# EAGLE design femtoBeacon_board_nRF52832_BT4.2_r1.0.0 (EAGLE 7.5.0)

## Sheet 1 of 2
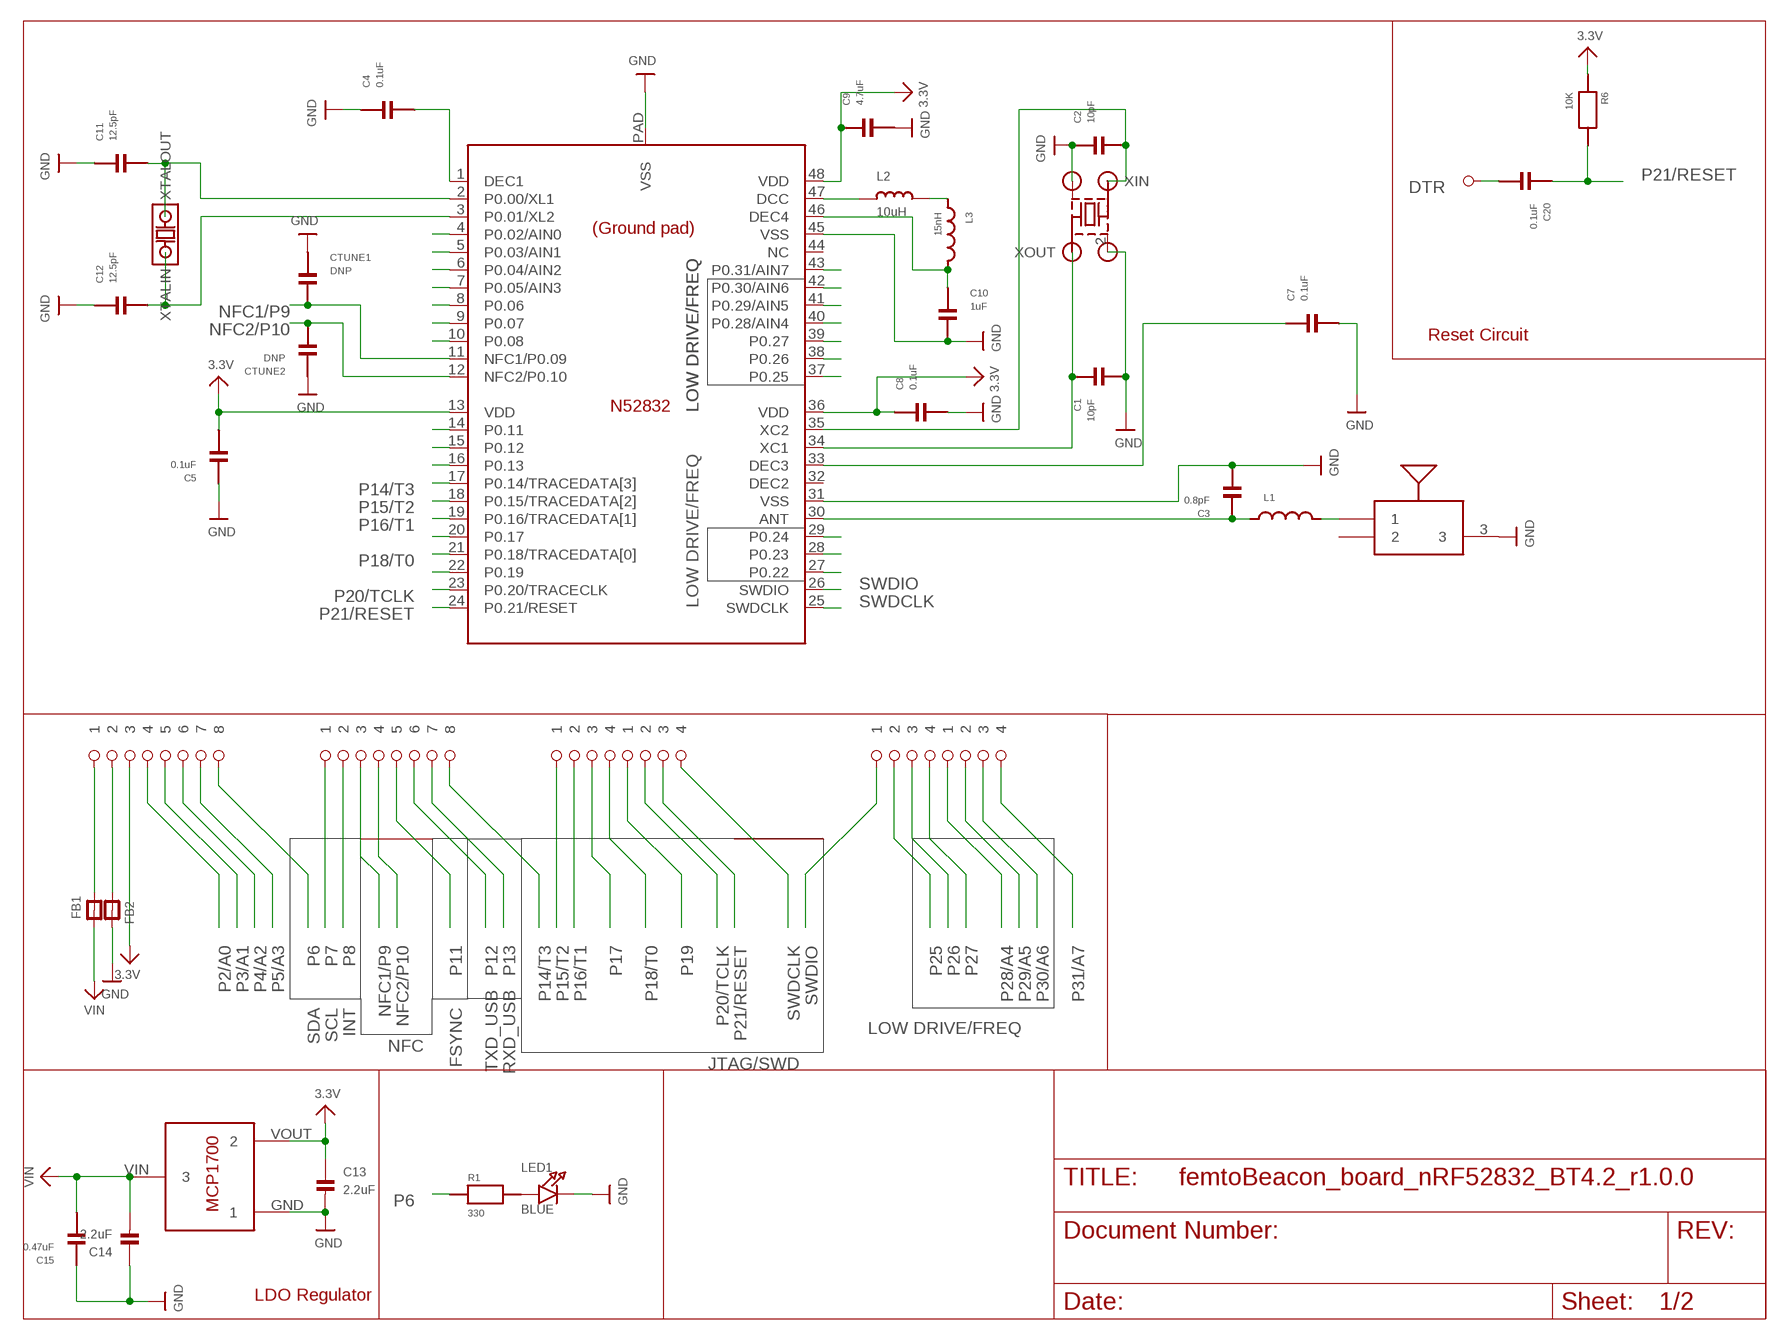
[diagram p0: schematic, sheet 1]

### Parts
ANTBAR  PULSE_ANT_2.4GHZ  [ANT_BAR]
C1  10pF  CAPACITOR_0201  [PART]
C2  10pF  CAPACITOR_0201  [PART]
C3  0.8pF  CAPACITOR_0201  [PART]
C4  0.1uF  CAPACITOR_0201  [PART]
C5  0.1uF  CAPACITOR_0201  [PART]
C7  0.1uF  CAPACITOR_0201  [PART]
C8  0.1uF  CAPACITOR_0201  [PART]
C9  4.7uF  CAPACITOR_0201  [PART]
C10  1uF  CAPACITOR_0201  [PART]
C11  12.5pF  CAPACITOR_0201  [PART]
C12  12.5pF  CAPACITOR_0201  [PART]
C13  2.2uF  CAP_CERAMIC_0402MP  [_0402MP]
C14  2.2uF  CAP_CERAMIC_0402MP  [_0402MP]
C15  0.47uF  CAPACITOR_0201  [PART]
C20  0.1uF  CAPACITOR_0201  [PART]
CTUNE1  DNP  CAPACITOR_0201  [PART]
CTUNE2  DNP  CAPACITOR_0201  [PART]
FB1  FERRITE_0603MP  [_0603MP]
FB2  FERRITE_0603MP  [_0603MP]
IC1  NRF52832_QFN48  [QFN48]
L1  INDUCTOR_FIXED_0201  [PART]
L2  10uH  INDUCTOR_0603MP  [_0603MP]
L3  15nH  INDUCTOR_FIXED_0201  [PART]
LED1  BLUE  LED0603_NOOUTLINE  [CHIPLED_0603_NOOUTLINE]
PIN4  1X1_ROUND  [1X1_ROUND]
PINS1  1X8_ROUND  [1X8_ROUND]
PINS2  1X8_ROUND  [1X8_ROUND]
PINS3A  1X4_ROUND  [1X4_ROUND]
PINS3B  1X4_ROUND  [1X4_ROUND]
PINS4A  1X4_ROUND  [1X4_ROUND]
PINS4B  1X4_ROUND  [1X4_ROUND]
R1  330  RESISTOR_0201  [PART]
R6  10K  RESISTOR_0201  [PART]
U$4  MCP1700T-3302E/TT  [MCP1700T-3302E/TT]
U$53  ABS06-107-32.768KHZ-T  [ABS06-107-32.768KHZ-T]
XTAL  32MHz  ABM11-32.000MHZ-D2X-T3  [ABM11]

### Nets
3.3V: C5.2 C8.1 C9.1 C13.1 IC1.13(VDD) IC1.36(VDD) IC1.48(VDD) PINS1.P$3 R6.1 U$4.VOUT ; also sheet 2
DTR: C20.2 PIN4.P$1
GND: ANTBAR.3 C1.2 C2.1 C3.2 C4.1 C5.1 C7.2 C8.2 C9.2 C10.2 C11.1 C12.1 C13.2 C14.1 C15.1 CTUNE1.1 CTUNE2.1 FB2.2 IC1.31(VSS) IC1.45(VSS) IC1.PAD(VSS) LED1.C U$4.GND XTAL.2(GND) XTAL.4(GND) ; also sheet 2
N$1: C4.2 IC1.1(DEC1)
N$2: L2.2 L3.1
N$3: IC1.47(DCC) L2.1
N$4: C7.1 IC1.33(DEC3)
N$5: FB2.1 PINS1.P$2
N$6: C10.1 IC1.46(DEC4) L3.2
N$7: LED1.A R1.2
N$8: FB1.2 PINS1.P$1
N$13: C3.1 IC1.30(ANT) L1.1
NFC1/P9: CTUNE1.2 IC1.11(NFC1/P0.09) PINS2.P$3
NFC2/P10: CTUNE2.2 IC1.12(NFC2/P0.10) PINS2.P$4
P0/XIN32: C11.2 IC1.2(P0.00/XL1) U$53.2(XTALOUT)
P1/XOUT32: C12.2 IC1.3(P0.01/XL2) U$53.1(XTALIN)
P2/A0: IC1.4(P0.02/AIN0) PINS1.P$4
P3/A1: IC1.5(P0.03/AIN1) PINS1.P$5
P4/A2: IC1.6(P0.04/AIN2) PINS1.P$6
P5/A3: IC1.7(P0.05/AIN3) PINS1.P$7
P6: IC1.8(P0.06) PINS1.P$8 R1.1 ; also sheet 2
P7: IC1.9(P0.07) PINS2.P$1 ; also sheet 2
P8: IC1.10(P0.08) PINS2.P$2 ; also sheet 2
P11: IC1.14(P0.11) PINS2.P$5 ; also sheet 2
P12: IC1.15(P0.12) PINS2.P$6
P13: IC1.16(P0.13) PINS2.P$7
P14/T3: IC1.17(P0.14/TRACEDATA[3]) PINS2.P$8
P15/T2: IC1.18(P0.15/TRACEDATA[2]) PINS3A.P$1
P16/T1: IC1.19(P0.16/TRACEDATA[1]) PINS3A.P$2
P17: IC1.20(P0.17) PINS3A.P$3
P18/T0: IC1.21(P0.18/TRACEDATA[0]) PINS3A.P$4
P19: IC1.22(P0.19) PINS3B.P$1
P20/TCLK: IC1.23(P0.20/TRACECLK) PINS3B.P$2
P21/RESET: C20.1 IC1.24(P0.21/RESET) PINS3B.P$3 R6.2
P22: IC1.27(P0.22)
P23: IC1.28(P0.23)
P24: IC1.29(P0.24)
P25: IC1.37(P0.25) PINS4A.P$2
P26: IC1.38(P0.26) PINS4A.P$3
P27: IC1.39(P0.27) PINS4A.P$4
P28/A4: IC1.40(P0.28/AIN4) PINS4B.P$1
P29/A5: IC1.41(P0.29/AIN5) PINS4B.P$2
P30/A6: IC1.42(P0.30/AIN6) PINS4B.P$3
P31/A7: IC1.43(P0.31/AIN7) PINS4B.P$4
RF: ANTBAR.1 L1.2
SWDCLK: IC1.25(SWDCLK) PINS3B.P$4
SWDIO: IC1.26(SWDIO) PINS4A.P$1
VIN: C14.2 C15.2 FB1.1 U$4.VIN
XIN: C1.1 IC1.34(XC1) XTAL.3(XOUT)
XOUT: C2.2 IC1.35(XC2) XTAL.1(XIN)
Unconnected: ANTBAR.2 IC1.32(DEC2) IC1.44(NC)

### Notes on the sheet
- Reset Circuit
- LOW DRIVE/FREQ | LOW DRIVE/FREQ
- LOW DRIVE/FREQ
- TXD_USB | RXD_USB
- SDA | SCL | INT | FSYNC
- LOW DRIVE/FREQ
- NFC
- JTAG/SWD
- LDO Regulator

## Sheet 2 of 2
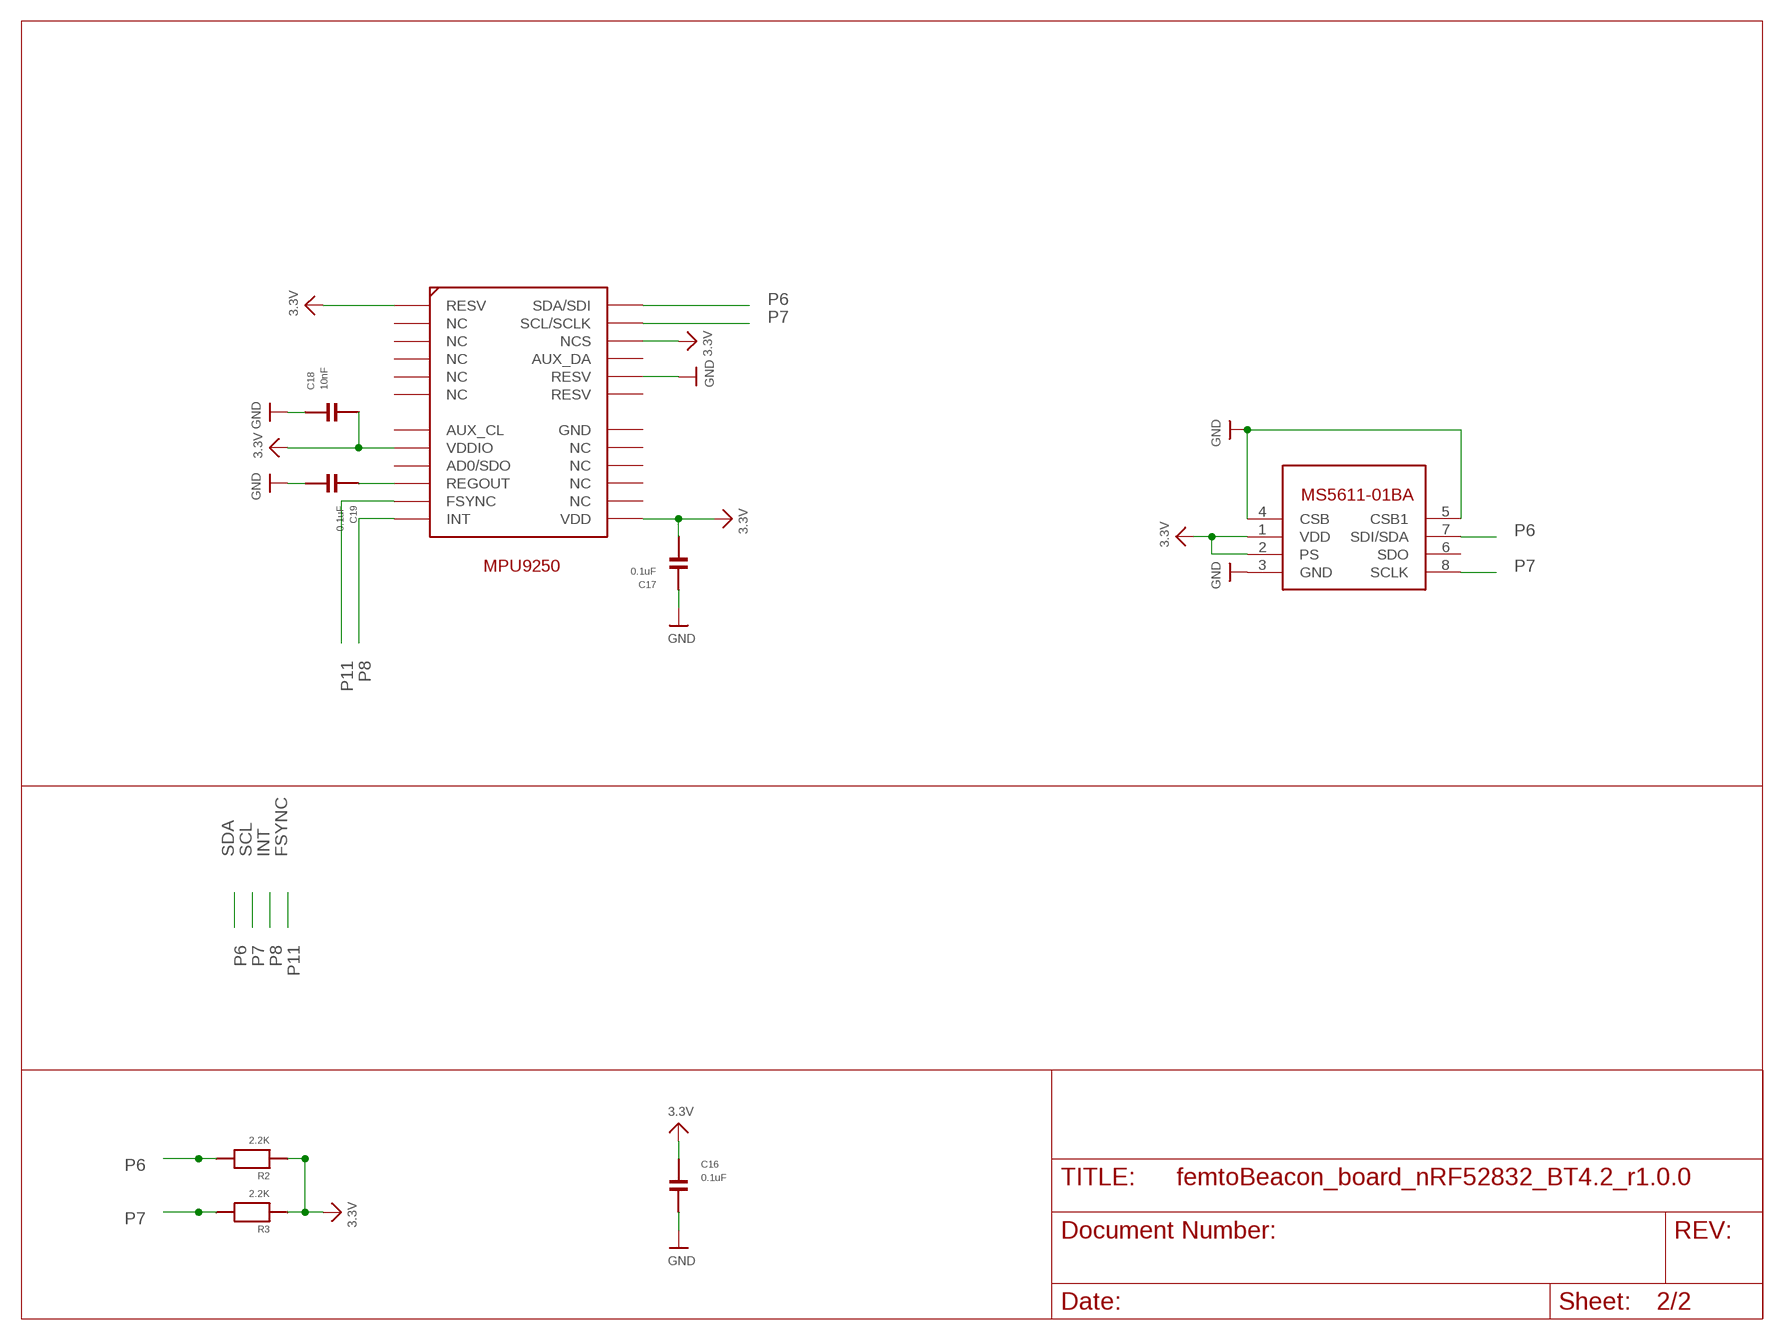
[diagram p1: schematic, sheet 2]

### Parts
BARO1  MS5611-01BA03  [MS5611-01BA03]
C16  0.1uF  CAPACITOR_0201  [PART]
C17  0.1uF  CAPACITOR_0201  [PART]
C18  10nF  CAPACITOR_0201  [PART]
C19  0.1uF  CAPACITOR_0201  [PART]
IMU1  MPU-9250  [QFN_3X3MM]
R2  2.2K  RESISTOR_0201  [PART]
R3  2.2K  RESISTOR_0201  [PART]

### Nets
3.3V: BARO1.1(VDD) BARO1.2(PS) C16.1 C17.2 C18.2 IMU1.P$1(RESV) IMU1.P$8(VDDIO) IMU1.P$13(VDD) IMU1.P$22(NCS) R2.1 R3.1 ; also sheet 1
GND: BARO1.3(GND) BARO1.4(CSB) BARO1.5(CSB1) C16.2 C17.1 C18.1 C19.2 IMU1.P$20(RESV) ; also sheet 1
P6: BARO1.7(SDI/SDA) IMU1.P$24(SDA/SDI) R2.2 ; also sheet 1
P7: BARO1.8(SCLK) IMU1.P$23(SCL/SCLK) R3.2 ; also sheet 1
P8: IMU1.P$12(INT) ; also sheet 1
P11: IMU1.P$11(FSYNC) ; also sheet 1
REGOUT: C19.1 IMU1.P$10(REGOUT)
Unconnected: BARO1.6(SDO) IMU1.P$2(NC) IMU1.P$3(NC) IMU1.P$4(NC) IMU1.P$5(NC) IMU1.P$6(NC) IMU1.P$7(AUX_CL) IMU1.P$9(AD0/SDO) IMU1.P$14(NC) IMU1.P$15(NC) IMU1.P$16(NC) IMU1.P$17(NC) IMU1.P$18(GND) IMU1.P$19(RESV) IMU1.P$21(AUX_DA)

### Notes on the sheet
- MPU9250
- SDA | SCL | INT | FSYNC

## Library data of the parts
ANTBAR = bar_antenna:PULSE_ANT_2.4GHZ: Manufacturer part #W3008
BARO1 = freeimu:MS5611-01BA03
C1-C5 C7-C12 C15-C20 CTUNE1 CTUNE2 = parts_0201:CAPACITOR_0201
C13 C14 = microbuilder:CAP_CERAMIC: Ceramic Capacitors 0402 - 0402 Surface Mount Capacitors 16pF 50V 5% [Digikey: 445-4899-2-ND] 18pF 50V 5% [Digikey: 490-1281-2-ND] 22pF 50V 5% [Digikey: 490-1283-2-ND] 68pF 50V 5% [Digikey: 490-1289-2-ND] 0.1uF 10V 10% [Digikey: 490-1318-2-ND] 1.0uF 6.3V 10% [Digikey: 490-1320-2-ND] 0603 - 0603 Surface Mount Capacitors 16 pF 50V 5% [Digikey: 445-5051-2-ND] 22 pF 50V [Digikey: PCC220ACVTR-ND] 33 pF 50V 5% [Digikey: 490-1415-1-ND] 56pF 50V 5% [Digikey: 490-1421-1-ND] 220pF 50V 5% [Digikey: 445-1285-1-ND] 680 pF 50V 2200 pF 50V 5% C0G [Digikey: 445-1297-1-ND] 5600 pF 100V 5% X7R [Digikey: 478-3711-1-ND] 0.1 µF 25V 10% [Digikey: PCC2277TR-ND] 0.22 µF 16V 10% X7R [Digikey: 445-1318-1-ND] 1.0 µF 25V 10% [Digikey: 445-5146-2-ND] 0603 - RF Specific 3pF 250V +/-0.1pF RF [Digikey: 712-1347-1-ND] 18 pF 250V 5% [Digikey: 478-3505-1-ND or 712-1322-1-ND] 56 pF 250V 5% C0G RF [Digikey: 490-4867-1-ND] 68 pF 250V RF [Digikey: 490-4868-1-ND] 0805 - 0805 Surface Mount Capacitors 220 pF 250V 2% RF Ceramic Capacitor [Digikey: 712-1398-1-ND] 1000 pF 50V 2% NP0 Ceramic Capacitor [Digikey: 478-3760-1-ND] 0.1 µF 25V 10% Ceramic Capacitor [Digikey: PCC1828TR-ND] 1.0 µF 16V 10% Ceramic Capacitor[Digikey: 490-1691-2-ND] 10.0 µF 10V 10% Ceramic Capacitor[Digikey: 709-1228-1-ND] 10.0 uF 16V 10% Ceramic Capacitor [Digikey: 478-5165-2-ND] 47 uF 6.3V 20% Ceramic Capacitor [Digikey: 587-1779-1-ND or 399-5506-1-ND] 1206 - 1206 Surface Mount Capacitors 47uF 10V 20% Ceramic Capacitor [Digikey: 490-5528-1-ND or 399-5508-1-ND or 445-6010-1-ND] 100uF 6.3V -20%, +80% Y5V Ceramic Capacitor (Digikey: 490-4512-1-ND, Mouser: 81-GRM31CF50J107ZE1L)
FB1 FB2 = microbuilder:FERRITE: Ferrite Bead 0603 MMZ1608B121C - 120 Ohm @ 100MHz, 600mA, 0.15 Ohm DC Resistance - Digikey: 445-2164-1-ND BK1608HW121-T - 120 Ohm, 600mA Ferrite Chip - Digikey: 587-1876-2-ND 0805 HZ0805B272R-10 - 2.7K Ohm @ 100MHz, 200mA, 0.8 Ohm DC Resistance - Digikey: 240-2504-1-ND (see also Murata BLM21BD272SN1L) MMZ2012Y152B - 1.5K Ohm @ 100MHz, 500mA, 0.4 Ohm DC Resistance - Digikey: 445-1560-1-ND - Mainly for high frequency (80-400MHz) MMZ2012R102A - 1K Ohm @ 100MHz, 500mA, 0.3 Ohm DC Resistance - Digikey: 445-1555-2-ND - More general purpose (10-200MHz)
IC1 = nordic-nrf52832:NRF52832_QFN48: Nordic nRF52832 QFN48 chip (6mm x 6mm). Supports BT 4.2, NFC, iPv6
IMU1 = mpu9250:MPU-9250
L1 L3 = parts_0201:INDUCTOR_FIXED_0201
L2 = microbuilder:INDUCTOR: Inductors 0603: 10nH Ceramic Inductor - microwire antenna/RF (Digikey: 712-1434-2-ND) 0805: 560nH Ceramic Inductor - RF (Digikey: 553-1047-1-ND) 270nH Ceramic Inductor - Q = 40@250MHz, +-5%, 1 Ohm DC Resistance (Digikey: 535-10506-2-ND) 1007 (2518 Metric) SMT: 10µH 10% 250mOhm 820mA 1007 Inductor (Digikey: 587-2189-1-ND) 22µH 10% 500mOhm 580mA 1007 Inductor (Digikey: 587-2190-1-ND) 47µH 10% 950mOhm 420mA 1007 Inductor (Digikey: 587-2191-1-ND) 47µH 5% 100mOhm 1A 1008 Inductor (Digikey: 732-1816-1-ND) 5.0x5.0mm (Taiyo Yuden NR5040 Series) 6.8µH 20% 2.3A 64mOhm Inductor (Digikey: 587-2374-2-ND) 5.0x5.0mm (TDK VLC5045 Series) 4.7µH 20% 3.3A 34mOhm Inductor (Digikey: 445-6526-1-ND) 6.8µH 20% 2.7A 46mOhm Inductor (Digikey: 445-6527-1-ND) 6.0x6.0mm (TDK VLC6045 Series) 4.7µH 20% 3.8A 27mOhm Inductor (Digikey: 445-6538-2-ND) 6.8µH 20% 3A 41mOhm Inductor (Digikey: 445-6540-1-ND) 6.2µH 30% 2.2A 45mOhm Inductor (Digikey: SRR5028-6R2YCT-ND) - Not TDK VLC6045 but footprint should match 6.0x6.0mm (TDK SLF6045 Series) 6.8uH 30% 2A 33mOhm Inductor (Digikey: 445-4572-1-ND, Mouser: 810-SLF645T6R8N2R0PF)
LED1 = microbuilder:LED: LED 0603 - 0603 Surface Mount Package 2mA: Green LED - Low Power (3.9mcd, 2ma, 1.7Vf) - Digikey: 475-2709-2-ND Orange LED - Low Power (9.8mcd, 2ma, 1.8Vf) - Digikey: 475-1194-2-ND Red LED - Low Power (5mcd, 2ma, 1.8Vf) - Digikey: 475-1195-2-ND Yellow LED - Low Power (7mcd, 2ma, 1.8Vf) - Digikey: 475-1196-2-ND 5mA: Blue LED - Low Power (17mcd, 5ma, 2.9Vf) - Digikey: LNJ937W8CRACT-ND 0805 - 0805 Surface Mount Package 2mA: Red LED (8.8mcd, 2mA, 1.8Vf, Clear) - Low Power [Digikey: 475-2510-1-ND] Green LED (5mcd, 2mA, 1.8Vf, Clear) - Low Power [Digikey: 475-2730-1-ND] Yellow LED (11.3mcd, 2mA, 1.8Vf, Clear) - Low Power [Digikey: 475-2555-1-ND] 20mA: Red LED (104mcd, 20mA, Diffused) - LS R976 [Digikey: 475-1278-6-ND] Red LED (12mcd, 20mA, 2.0Vf, Clear) - APT2012EC [Digikey: 754-1128-1-ND] Green LED (15mcd, 20mA, 2.2Vf, Clear) - APT2012GC [Digikey: 754-1131-1-ND] Orange LED (160mcd, 20mA, 2.1Vf, Clear) - APT2012SECK [Digikey: 754-1130-1-ND] 1206 - 1206 Surface Mount Package Green LED (26mcd, 20mA, Diffused) - LG N971 [Digikey: 475-1407-6-ND] Red LED (15mcd, 20mA, Diffused) - LH N974 [Digikey: 475-1416-6-ND]
PIN4 = pins_1.27mm_pitch:1X1_ROUND
PINS1 PINS2 = pins_1.27mm_pitch:1X8_ROUND
PINS3A PINS3B PINS4A PINS4B = pins_1.27mm_pitch:1X4_ROUND
R1-R3 R6 = parts_0201:RESISTOR_0201
U$4 = MCP1700T-3302E_TT:MCP1700T-3302E/TT: Microchip LDO "MCP1700" in a 3-Pin SOT-23 package. ID: MCP1700T-3302E/TT
U$53 = crystals:ABS06-107-32.768KHZ-T: ABS06-107-32.768kHz-T Crystal Oscillator
XTAL = crystals:ABM11-32.000MHZ-D2X-T3: Mouser part 815-ABM11-32-D2XT3

## Board
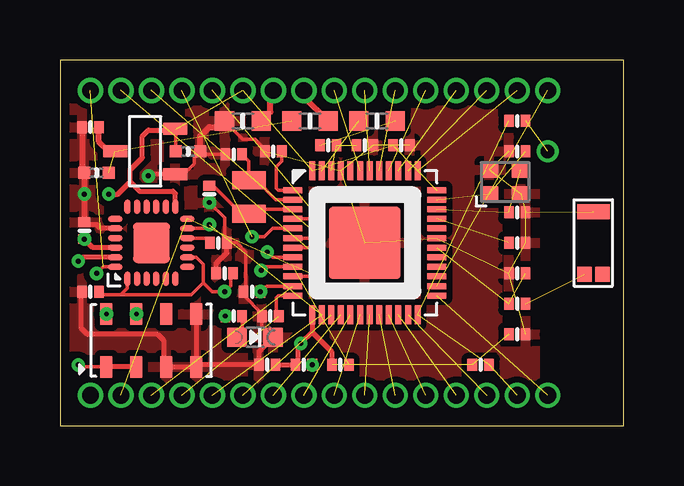
[diagram p2: board, top side]
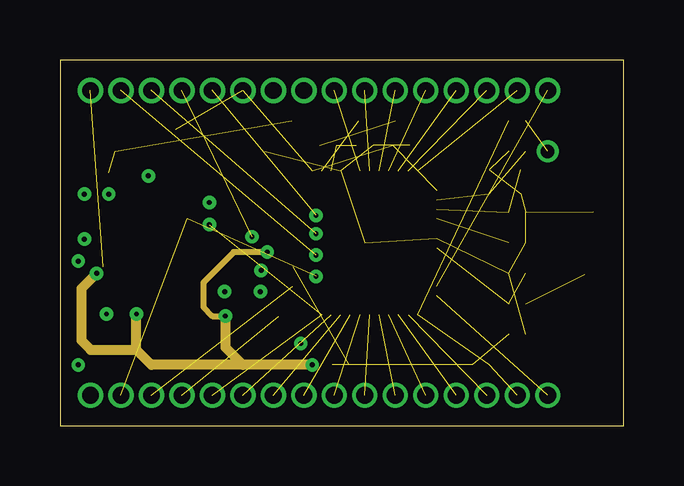
[diagram p3: board, inner layer Route2]
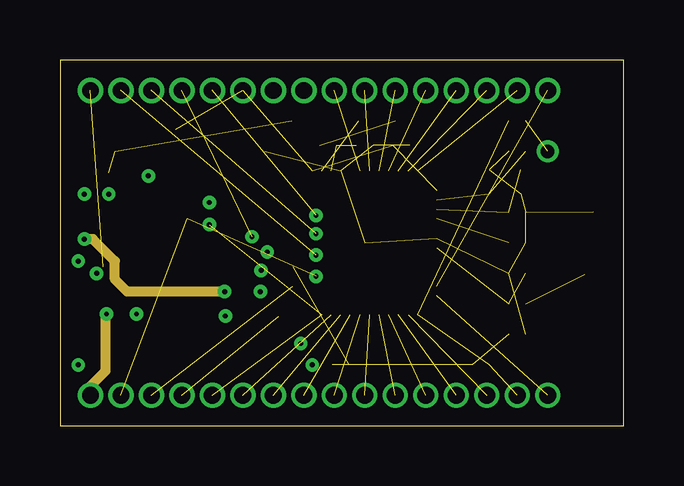
[diagram p4: board, inner layer Route15]
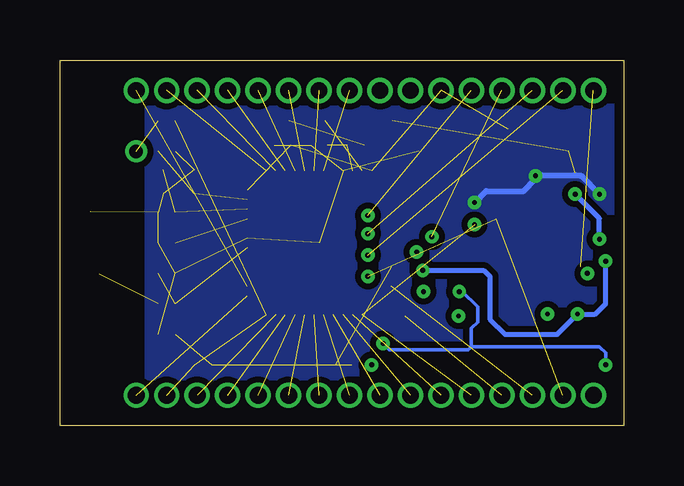
[diagram p5: board, bottom side, seen from below]

Size 23.5 x 15.24 mm. Coordinates in mm from the lower left corner, seen from the top.
Outline: 0,0 23.5,0 23.5,15.24 0,15.24 0,0
Copper layers (1+2*15+16): Top 0.0356mm / dielectric 1.5011mm / Route2 0.0356mm / dielectric 0.1499mm / Route15 0.0356mm / dielectric 0.2007mm / Bottom 0.0356mm
Design rules "LaenPCBOrder_custom_4layer": minimum track width 5mil, minimum drill 5mil, track to track 5mil, track to pad 5mil, pad to pad 5mil, via to via 5mil, smd to smd 5mil, copper to edge 15mil, drill to drill 6mil, minimum pad ring 7mil, minimum via ring 7mil, stop-mask expansion 2mil, vias tented up to drill 5mil, thermal gap 10mil
tRestrict: area 20.3,0 to 23.5,15.2
bRestrict: area 20.3,0 to 23.5,15.2

### Footprints (pad centres in the part's own frame; a part is rotated, then mirrored left to right if it is on the bottom)
ANT_BAR = smd 0.62 x 0.61: 1 -1.3,0.37; 2 -1.3,-0.38 | smd 0.62 x 1.36: 3 1.3,0
MS5611-01BA03 = smd 0.9 x 0.5: 1 -1.1,1.875; 2 -1.1,0.625; 3 -1.1,-0.625; 4 -1.1,-1.875; 5 1.1,-1.875; 6 1.1,-0.625; 7 1.1,0.625; 8 1.1,1.875
PART = smd 0.4 x 0.5: 1 -0.35,0; 2 0.35,0
_0402MP = smd 0.5 x 0.5: 1 -0.508,0; 2 0.508,0
_0603MP = smd 0.8 x 0.8: 1 -0.762,0; 2 0.762,0
QFN48 = smd 0.8 x 0.25: 1 -3,2.2; 2 -3,1.8; 3 -3,1.4; 4 -3,1; 5 -3,0.6; 6 -3,0.2; 7 -3,-0.2; 8 -3,-0.6; 9 -3,-1; 10 -3,-1.4; 11 -3,-1.8; 12 -3,-2.2; 25 3,-2.2; 26 3,-1.8; 27 3,-1.4; 28 3,-1; 29 3,-0.6; 30 3,-0.2; 31 3,0.2; 32 3,0.6; 33 3,1; 34 3,1.4; 35 3,1.8; 36 3,2.2 | smd 0.25 x 0.8: 13 -2.2,-3; 14 -1.8,-3; 15 -1.4,-3; 16 -1,-3; 17 -0.6,-3; 18 -0.2,-3; 19 0.2,-3; 20 0.6,-3; 21 1,-3; 22 1.4,-3; 23 1.8,-3; 24 2.2,-3; 37 2.2,3; 38 1.8,3; 39 1.4,3; 40 1,3; 41 0.6,3; 42 0.2,3; 43 -0.2,3; 44 -0.6,3; 45 -1,3; 46 -1.4,3; 47 -1.8,3; 48 -2.2,3 | smd 3 x 3: PAD 0,0
QFN_3X3MM = smd 0.6 x 0.25: P$1 -1.5,1; P$2 -1.5,0.6; P$3 -1.5,0.2; P$4 -1.5,-0.2; P$5 -1.5,-0.6; P$6 -1.5,-1; P$13 1.5,-1; P$14 1.5,-0.6; P$15 1.5,-0.2; P$16 1.5,0.2; P$17 1.5,0.6; P$18 1.5,1 | smd 0.25 x 0.6: P$7 -1,-1.5; P$8 -0.6,-1.5; P$9 -0.2,-1.5; P$10 0.2,-1.5; P$11 0.6,-1.5; P$12 1,-1.5; P$19 1,1.5; P$20 0.6,1.5; P$21 0.2,1.5; P$22 -0.2,1.5; P$23 -0.6,1.5; P$24 -1,1.5 | smd 1.7 x 1.54: P$25 0,0
CHIPLED_0603_NOOUTLINE = smd 0.8 x 0.8: A 0,-0.75; C 0,0.75
1X1_ROUND = drill 0.559 pad 0.864: P$1 0,0
1X8_ROUND = drill 0.7 pad 1: P$1 0,0; P$2 0,-1.27; P$3 0,-2.54; P$4 0,-3.81; P$5 0,-5.08; P$6 0,-6.35; P$7 0,-7.62; P$8 0,-8.89
1X4_ROUND = drill 0.7 pad 1: P$1 0,0; P$2 0,-1.27; P$3 0,-2.54; P$4 0,-3.81
MCP1700T-3302E/TT = smd 0.5 x 1: GND -0.95,-1.25; VIN 0,1.25; VOUT 0.95,-1.25
ABS06-107-32.768KHZ-T = smd 0.75 x 1.4: 1 -0.7,0; 2 0.7,0
ABM11 = smd 0.75 x 0.65: 1 -0.65,-0.5; 2 0.65,-0.5; 3 0.65,0.5; 4 -0.65,0.5

### Placement (x,y rotation side)
ANTBAR  22.23,7.62 90 top
BARO1  3.81,3.56 90 top
C1  19.05,8.89 0 top
C2  19.05,11.43 0 top
C3  19.05,6.35 180 top
C4  8.89,11.43 0 top
C5  8.64,2.54 0 top
C7  19.05,7.62 0 top
C8  19.05,3.81 0 top
C9  14.22,11.68 0 top
C10  12.7,11.68 0 top
C11  7.24,11.3 0 top
C12  6.22,9.65 90 top
C13  5.33,11.43 0 top
C14  1.52,10.54 0 top
C15  1.27,12.45 0 top
C16  1.02,8.13 90 top
C17  6.86,6.35 0 top
C18  1.27,5.59 0 top
C19  6.6,7.62 0 top
C20  19.05,12.7 0 top
CTUNE1  8,5.59 0 top
CTUNE2  8.76,4.57 0 top
FB1  10.41,12.7 0 top
FB2  7.62,12.7 180 top
IC1  12.7,7.62 0 top
IMU1  3.81,7.62 90 top
L1  19.05,5.08 0 top
L2  13.21,12.7 0 top
L3  11.18,11.68 0 top
LED1  8.13,3.68 270 top
PIN4  20.32,11.43 0 top
PINS1  10.16,13.97 270 top
PINS2  1.27,1.27 90 top
PINS3A  11.43,1.27 90 top
PINS3B  16.51,1.27 90 top
PINS4A  20.32,13.97 270 top
PINS4B  15.24,13.97 270 top
R1  7.24,4.57 0 top
R2  10.16,2.54 0 top
R3  11.68,2.54 0 top
R6  17.53,2.54 0 top
U$4  3.56,11.43 90 top
U$53  7.87,9.53 90 top
XTAL  18.54,10.16 0 top

### Tracks (layer width: path | path; a pad name or v marks a point on that pad's centre or on a via)
3.3V  (via drill 0.2 pad 0.51)  (6 unrouted)
  Top 0.152: IMU1.P$1 2.81,5.73 2.54,5.46 | IMU1.P$8 5.68,7.02 5.97,6.73 5.97,5.97 | 5.97,5.97 5.46,5.46 2.54,5.46 | C17.2 7.11,6.25 7.11,5.84 v6.86,5.59 6.35,5.59 5.97,5.97 | 2.54,5.46 1.75,5.46 C18.2 | BARO1.1 0.85,2.46 v0.76,2.54 | C13.1 4.83,12.36 U$4.VOUT
  Top 0.203: IMU1.P$22 1.37,7.42 C16.1 | C5.2 R2.1 9.91,2.64 9.91,3.3 v10.03,3.43 10.5,3.9 | IC1.13 10.5,3.9 | R3.1 11.33,3.06 10.5,3.9 | BARO1.2 BARO1.1 | v2.03,9.65 2.41,9.65 2.92,10.16 | 2.92,10.16 2.92,10.67 3.43,11.18 3.43,12.06 3.68,12.32 4.75,12.32 U$4.VOUT | 2.92,10.16 3.3,9.78 4.7,9.78 4.81,9.67 IMU1.P$13
  Route15 0.406: v6.86,5.59 2.79,5.59 2.29,6.1 2.29,6.86 1.37,7.78 C16.1
  Bottom 0.152: v10.03,3.43 9.78,3.17 6.48,3.17 6.35,3.3 | v0.76,2.54 0.76,3.05 1.02,3.3 6.35,3.3 | 6.35,3.3 6.35,4.06 6.1,4.32 6.1,4.95 6.73,5.59 v6.86,5.59
  Bottom 0.203: C16.1 1.02,8.64 v2.03,9.65
  other vias: 1.02,7.78
DTR  (1 unrouted)
GND  (via drill 0.2 pad 0.51)  (13 unrouted)
  Top 0.152: 6.73,6.99 6.6,6.86 | LED1.C 8.41,4.15 CTUNE2.1 8.41,4.67 7.65,5.43 CTUNE1.1 7.75,5.68 7.75,7.24 7.37,7.62 C19.2 6.86,7.72 6.86,8.67 C12.1 | 6.76,12.6 FB2.2 7.62,11.94 8.13,11.94 8.54,11.53 C4.1 | U$4.GND 5.15,10.48 5.59,10.92 5.59,11.18 C13.2 5.97,11.3 C11.1
  Top 0.203: BARO1.4 BARO1.3 4.32,2.83 4.32,3.56 4.06,3.81 1.14,3.81 0.89,4.06 0.89,5.56 C18.1 | BARO1.5 BARO1.4 | C17.1 6.51,6.76 6.6,6.86 6.95,7.21 C19.2 | BARO1.4 5.86,2.54 C5.1 8.29,3.09 LED1.C | IMU1.P$20 1.69,8.22 1.52,8.38 1.11,8.38 C16.2 | U$4.GND 3.75,10.48 v3.68,10.41
  Top 0.254: C15.1 0.92,10.51 C14.1 v1.02,9.65 C16.2 | C13.2 5.84,12.06 6.22,12.45 6.6,12.45 FB2.2
  Bottom 0.254: C12.1 5.75,9.78 4.19,9.78 3.68,10.29 v3.68,10.41 1.78,10.41 v1.02,9.65
  other vias: 6.22,9.3
  pour Bottom (isolate 0.254): 0,15.24 20.32,15.24 20.32,0 0,0
  pour Top (isolate 0.254): 0,15.24 0,0 20.32,0 20.32,15.24
N$1
  Top 0.152: IC1.1 9.1,9.82 9.02,9.91 9.02,10.79 9.24,11.02 C4.2
N$2  (1 unrouted)
N$3  (1 unrouted)
N$4  (1 unrouted)
N$5
  Top 0.254: FB2.1 8.76,13.08 8.76,13.84 PINS1.P$2
N$6  (2 unrouted)
N$7
  Top 0.152: R1.2 7.59,3.89 LED1.A
N$8
  Top 0.254: FB1.2 10.16,13.72 PINS1.P$1
N$13  (2 unrouted)
NFC1/P9  (via drill 0.2 pad 0.51)  (1 unrouted)
  Top 0.152: IC1.11 8.61,5.82 8.38,5.59 CTUNE1.2
  other vias: 8.35,5.59
NFC2/P10  (1 unrouted)
  Top 0.152: IC1.12 9.1,5.42 9.02,5.33 9.02,4.73 CTUNE2.2
P0/XIN32
  Top 0.152: IC1.2 8.99,9.42 8.19,10.22 U$53.2 7.87,11.02 C11.2
P1/XOUT32
  Top 0.152: IC1.3 8.07,9.02 U$53.1 7.56,8.82 6.38,10 C12.2
P2/A0  (via drill 0.2 pad 0.51)  (1 unrouted)
  Top 0.152: IC1.4 10.53,8.62 v10.67,8.76
P3/A1  (via drill 0.2 pad 0.51)  (1 unrouted)
  Top 0.152: IC1.5 8.86,8.22 8.51,7.87 v8,7.87
P4/A2  (via drill 0.2 pad 0.51)  (1 unrouted)
  Top 0.152: IC1.6 10.49,7.82 v10.67,8
P5/A3  (via drill 0.2 pad 0.51)  (1 unrouted)
  Top 0.152: IC1.7 10.36,7.42 v10.67,7.11
P6  (via drill 0.2 pad 0.51)  (1 unrouted)
  Top 0.152: IMU1.P$24 1.79,6.62 v1.52,6.35 | IC1.8 8.86,7.02 v8.64,7.24
  Route2 0.254: v8.64,7.24 7.24,7.24 5.97,5.97 5.97,4.95 6.35,4.57 R1.1
  Route2 0.406: R2.2 7.62,2.54 | 7.62,2.54 3.81,2.54 3.19,3.17 | 3.19,3.17 BARO1.7 | R1.1 6.89,3.27 7.62,2.54 | v1.52,6.35 0.89,5.71 0.89,3.56 1.28,3.17 3.19,3.17
  other vias: 10.51,2.54 3.19,4.66 6.89,4.57
P7  (via drill 0.2 pad 0.51)  (1 unrouted)
  Top 0.152: IC1.9 8.53,6.62 v8.38,6.48
  Top 0.203: IMU1.P$23 0.92,7.02 v0.76,6.86
  Route15 0.406: PINS2.P$1 1.27,1.65 1.91,2.29 1.91,4.63 BARO1.8
  Bottom 0.203: v0.76,6.86 0.76,5.08 1.19,4.66 BARO1.8 2.78,3.81 4.95,3.81 5.59,4.45 5.59,6.22 5.84,6.48 v8.38,6.48
  other vias: 1.94,4.66
P8  (via drill 0.2 pad 0.51)  (2 unrouted)
  Top 0.152: IC1.10 v10.66,6.22 v10.67,6.22
P11  (via drill 0.2 pad 0.51)  (2 unrouted)
  Top 0.152: IMU1.P$11 6.06,8.22 v6.22,8.38
P12  (1 unrouted)
P13  (1 unrouted)
P14/T3  (1 unrouted)
P15/T2  (1 unrouted)
P16/T1  (1 unrouted)
P17  (1 unrouted)
P18/T0  (1 unrouted)
P19  (1 unrouted)
P20/TCLK  (1 unrouted)
P21/RESET  (3 unrouted)
P25  (1 unrouted)
P26  (1 unrouted)
P27  (1 unrouted)
P28/A4  (1 unrouted)
P29/A5  (1 unrouted)
P30/A6  (1 unrouted)
P31/A7  (1 unrouted)
REGOUT
  Top 0.152: IMU1.P$10 6.05,7.82 C19.1
RF  (1 unrouted)
SWDCLK  (1 unrouted)
SWDIO  (1 unrouted)
VIN  (2 unrouted)
  Top 0.254: U$4.VIN 2.03,11.43 1.62,11.84 C15.2
XIN  (2 unrouted)
XOUT  (2 unrouted)